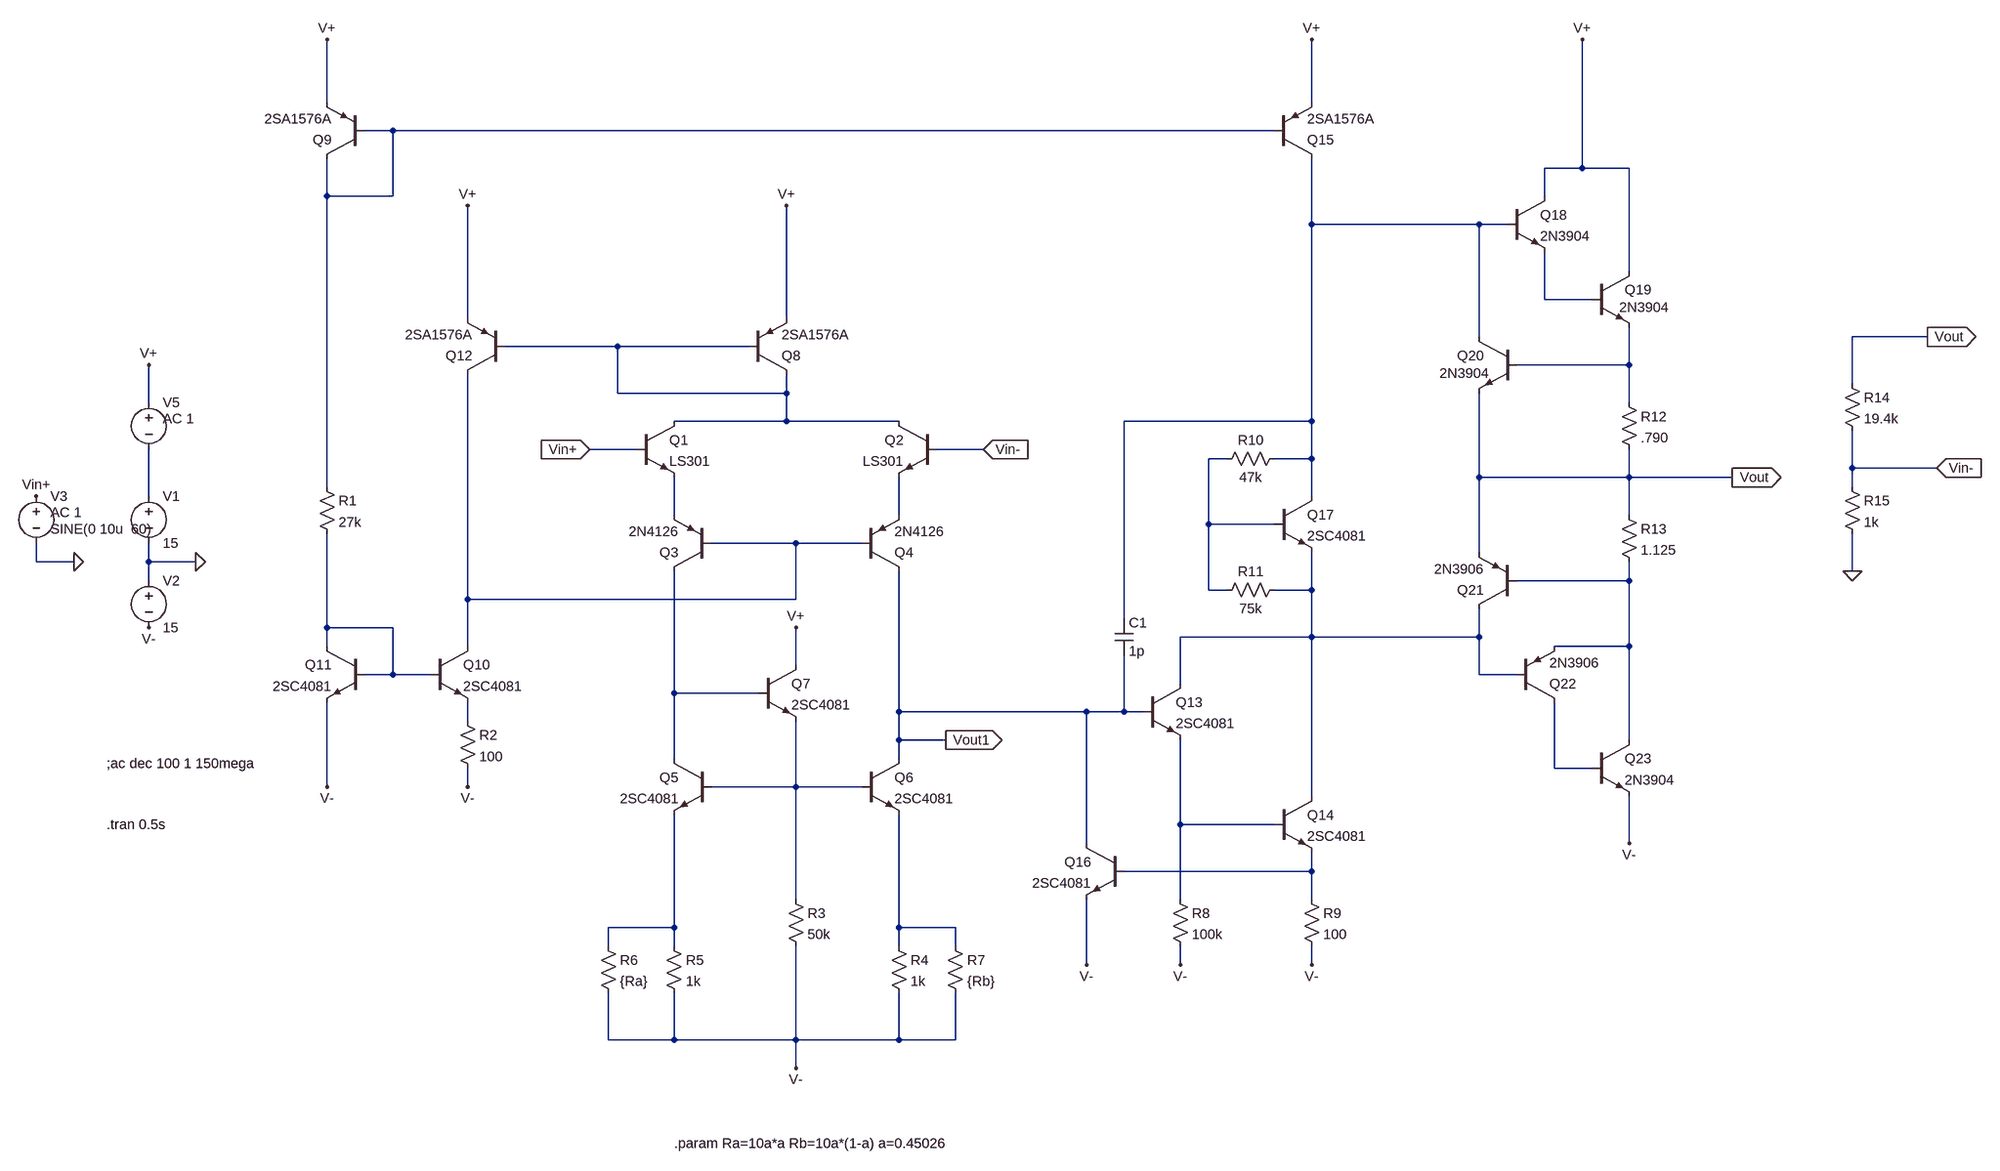
[diagram p0: schematic 741.asc]
741.asc, the LTspice schematic file:
Version 4
SHEET 1 3800 1252
WIRE 16 -736 16 -912
WIRE 1696 -736 1696 -912
WIRE 128 -688 80 -688
WIRE 1632 -688 128 -688
WIRE 2256 -624 2256 -912
WIRE 2256 -624 2192 -624
WIRE 2336 -624 2256 -624
WIRE 16 -576 16 -640
WIRE 128 -576 128 -688
WIRE 128 -576 16 -576
WIRE 2192 -576 2192 -624
WIRE 1696 -528 1696 -640
WIRE 2080 -528 1696 -528
WIRE 2128 -528 2080 -528
WIRE 2336 -448 2336 -624
WIRE 2192 -400 2192 -480
WIRE 2272 -400 2192 -400
WIRE 256 -368 256 -560
WIRE 800 -368 800 -560
WIRE 2080 -336 2080 -528
WIRE 3680 -336 3552 -336
WIRE 512 -320 320 -320
WIRE 736 -320 512 -320
WIRE 2336 -288 2336 -352
WIRE 2336 -288 2144 -288
WIRE 3552 -256 3552 -336
WIRE 512 -240 512 -320
WIRE 800 -240 800 -272
WIRE 800 -240 512 -240
WIRE -288 -224 -288 -288
WIRE 2336 -224 2336 -288
WIRE 800 -192 800 -240
WIRE 800 -192 608 -192
WIRE 992 -192 800 -192
WIRE 1696 -192 1696 -528
WIRE 1696 -192 1376 -192
WIRE 544 -144 464 -144
WIRE 1136 -144 1056 -144
WIRE 1552 -128 1520 -128
WIRE 1696 -128 1696 -192
WIRE 1696 -128 1632 -128
WIRE 3552 -112 3552 -176
WIRE 3696 -112 3552 -112
WIRE 2080 -96 2080 -240
WIRE 2336 -96 2336 -144
WIRE 2336 -96 2080 -96
WIRE 2512 -96 2336 -96
WIRE 16 -80 16 -576
WIRE 3552 -80 3552 -112
WIRE -288 -64 -288 -144
WIRE 1696 -64 1696 -128
WIRE 608 -32 608 -96
WIRE 992 -32 992 -96
WIRE 2336 -32 2336 -96
WIRE 1520 -16 1520 -128
WIRE 1632 -16 1520 -16
WIRE 816 16 672 16
WIRE 928 16 816 16
WIRE 2080 32 2080 -96
WIRE -480 48 -480 16
WIRE -416 48 -480 48
WIRE -288 48 -288 16
WIRE -208 48 -288 48
WIRE 3552 64 3552 0
WIRE -288 80 -288 48
WIRE 2336 80 2336 48
WIRE 2336 80 2144 80
WIRE 1520 96 1520 -16
WIRE 1552 96 1520 96
WIRE 1696 96 1696 32
WIRE 1696 96 1632 96
WIRE 256 112 256 -272
WIRE 816 112 816 16
WIRE 816 112 256 112
WIRE 1376 144 1376 -192
WIRE 16 160 16 0
WIRE 128 160 16 160
WIRE 1696 176 1696 96
WIRE 1696 176 1472 176
WIRE 2080 176 2080 128
WIRE 2080 176 1696 176
WIRE 16 192 16 160
WIRE 256 192 256 112
WIRE 2336 192 2336 80
WIRE 2336 192 2208 192
WIRE 816 224 816 160
WIRE 128 240 128 160
WIRE 128 240 80 240
WIRE 192 240 128 240
WIRE 2080 240 2080 176
WIRE 2144 240 2080 240
WIRE 1472 256 1472 176
WIRE 608 272 608 64
WIRE 752 272 608 272
WIRE 992 304 992 64
WIRE 1312 304 992 304
WIRE 1376 304 1376 208
WIRE 1376 304 1312 304
WIRE 1408 304 1376 304
WIRE 256 320 256 288
WIRE 992 352 992 304
WIRE 1072 352 992 352
WIRE 2336 352 2336 192
WIRE 608 384 608 272
WIRE 992 384 992 352
WIRE 2208 400 2208 288
WIRE 2272 400 2208 400
WIRE 16 432 16 288
WIRE 256 432 256 400
WIRE 816 432 816 320
WIRE 816 432 672 432
WIRE 928 432 816 432
WIRE 1696 448 1696 176
WIRE 1472 496 1472 352
WIRE 1632 496 1472 496
WIRE 1312 528 1312 304
WIRE 2336 528 2336 448
WIRE 1696 576 1696 544
WIRE 1696 576 1376 576
WIRE 816 624 816 432
WIRE 1472 624 1472 496
WIRE 1696 624 1696 576
WIRE 608 672 608 480
WIRE 608 672 496 672
WIRE 992 672 992 480
WIRE 1088 672 992 672
WIRE 496 704 496 672
WIRE 608 704 608 672
WIRE 992 704 992 672
WIRE 1088 704 1088 672
WIRE 1312 736 1312 624
WIRE 1472 736 1472 704
WIRE 1696 736 1696 704
WIRE 496 864 496 784
WIRE 608 864 608 784
WIRE 608 864 496 864
WIRE 816 864 816 704
WIRE 816 864 608 864
WIRE 992 864 992 784
WIRE 992 864 816 864
WIRE 1088 864 1088 784
WIRE 1088 864 992 864
WIRE 816 912 816 864
FLAG -208 48 0
FLAG -288 160 V-
FLAG 16 432 V-
FLAG 16 -912 V+
FLAG 256 432 V-
FLAG 256 -560 V+
FLAG 800 -560 V+
FLAG -416 48 0
FLAG -480 -64 Vin+
FLAG 464 -144 Vin+
IOPIN 464 -144 In
FLAG 1136 -144 Vin-
IOPIN 1136 -144 In
FLAG 1072 352 Vout1
IOPIN 1072 352 Out
FLAG 816 160 V+
FLAG 816 912 V-
FLAG 1472 736 V-
FLAG 1696 736 V-
FLAG 1696 -912 V+
FLAG 1312 736 V-
FLAG 2256 -912 V+
FLAG 2336 528 V-
FLAG 2512 -96 Vout
IOPIN 2512 -96 Out
FLAG 3552 64 0
FLAG 3696 -112 Vin-
IOPIN 3696 -112 In
FLAG 3680 -336 Vout
IOPIN 3680 -336 Out
FLAG -288 -288 V+
SYMBOL voltage -288 -80 R0
WINDOW 123 0 0 Left 0
WINDOW 39 0 0 Left 0
SYMATTR InstName V1
SYMATTR Value 15
SYMBOL voltage -288 64 R0
WINDOW 123 0 0 Left 0
WINDOW 39 0 0 Left 0
SYMATTR InstName V2
SYMATTR Value 15
SYMBOL res 0 -96 R0
SYMATTR InstName R1
SYMATTR Value 27k
SYMBOL res 240 304 R0
SYMATTR InstName R2
SYMATTR Value 100
SYMBOL pnp 736 -272 M180
SYMATTR InstName Q8
SYMATTR Value 2SA1576A
SYMBOL voltage -480 -80 R0
WINDOW 123 24 44 Left 2
WINDOW 39 0 0 Left 0
WINDOW 3 24 72 Left 2
SYMATTR Value2 AC 1
SYMATTR Value SINE(0 10u  60)
SYMATTR InstName V3
SYMBOL npn 544 -192 R0
SYMATTR InstName Q1
SYMATTR Value LS301
SYMBOL pnp 672 64 R180
SYMATTR InstName Q3
SYMATTR Value 2N4126
SYMBOL pnp 928 64 M180
SYMATTR InstName Q4
SYMATTR Value 2N4126
SYMBOL npn 672 384 M0
SYMATTR InstName Q5
SYMATTR Value 2SC4081
SYMBOL res 800 608 R0
SYMATTR InstName R3
SYMATTR Value 50k
SYMBOL res 976 688 R0
SYMATTR InstName R4
SYMATTR Value 1k
SYMBOL res 592 688 R0
SYMATTR InstName R5
SYMATTR Value 1k
SYMBOL res 480 688 R0
SYMATTR InstName R6
SYMATTR Value {Ra}
SYMBOL res 1072 688 R0
SYMATTR InstName R7
SYMATTR Value {Rb}
SYMBOL npn 928 384 R0
SYMATTR InstName Q6
SYMATTR Value 2SC4081
SYMBOL npn 752 224 R0
SYMATTR InstName Q7
SYMATTR Value 2SC4081
SYMBOL npn 1056 -192 M0
SYMATTR InstName Q2
SYMATTR Value LS301
SYMBOL pnp 80 -640 R180
SYMATTR InstName Q9
SYMATTR Value 2SA1576A
SYMBOL pnp 320 -272 R180
SYMATTR InstName Q12
SYMATTR Value 2SA1576A
SYMBOL npn 192 192 R0
SYMATTR InstName Q10
SYMATTR Value 2SC4081
SYMBOL npn 80 192 M0
SYMATTR InstName Q11
SYMATTR Value 2SC4081
SYMBOL npn 1408 256 R0
SYMATTR InstName Q13
SYMATTR Value 2SC4081
SYMBOL npn 1632 448 R0
SYMATTR InstName Q14
SYMATTR Value 2SC4081
SYMBOL res 1456 608 R0
SYMATTR InstName R8
SYMATTR Value 100k
SYMBOL res 1680 608 R0
SYMATTR InstName R9
SYMATTR Value 100
SYMBOL pnp 1632 -640 M180
SYMATTR InstName Q15
SYMATTR Value 2SA1576A
SYMBOL npn 1376 528 M0
SYMATTR InstName Q16
SYMATTR Value 2SC4081
SYMBOL npn 1632 -64 R0
SYMATTR InstName Q17
SYMATTR Value 2SC4081
SYMBOL res 1648 -144 R90
WINDOW 0 0 56 VBottom 2
WINDOW 3 32 56 VTop 2
SYMATTR InstName R10
SYMATTR Value 47k
SYMBOL res 1648 80 R90
WINDOW 0 0 56 VBottom 2
WINDOW 3 32 56 VTop 2
SYMATTR InstName R11
SYMATTR Value 75k
SYMBOL npn 2128 -576 R0
SYMATTR InstName Q18
SYMATTR Value 2N3904
SYMBOL npn 2272 -448 R0
WINDOW 3 47 62 Left 2
SYMATTR Value 2N3904
SYMATTR InstName Q19
SYMBOL res 2320 -240 R0
SYMATTR InstName R12
SYMATTR Value .790
SYMBOL res 2320 -48 R0
SYMATTR InstName R13
SYMATTR Value 1.125
SYMBOL npn 2144 -336 M0
WINDOW 3 47 62 Left 2
SYMATTR Value 2N3904
SYMATTR InstName Q20
SYMBOL pnp 2144 128 R180
SYMATTR InstName Q21
SYMATTR Value 2N3906
SYMBOL pnp 2144 288 M180
SYMATTR InstName Q22
SYMATTR Value 2N3906
SYMBOL npn 2272 352 R0
SYMATTR InstName Q23
SYMATTR Value 2N3904
SYMBOL cap 1360 144 R0
SYMATTR InstName C1
SYMATTR Value 1p
SYMBOL res 3536 -272 R0
SYMATTR InstName R14
SYMATTR Value 19.4k
SYMBOL res 3536 -96 R0
SYMATTR InstName R15
SYMATTR Value 1k
SYMBOL voltage -288 -240 R0
WINDOW 123 24 44 Left 2
WINDOW 39 0 0 Left 0
SYMATTR Value2 AC 1
SYMATTR InstName V5
SYMATTR Value ""
TEXT 608 1040 Left 2 !.param Ra=10a*a Rb=10a*(1-a) a=0.45026
TEXT -360 392 Left 2 !;ac dec 100 1 150mega
TEXT -360 496 Left 2 !.tran 0.5s

The netlist it stands for:
* 741.asc
V1 N007 0 15
V2 0 V- 15
R1 N001 N013 27k
R2 N015 V- 100
Q8 N004 N004 V+ 0 2SA1576A
V3 Vin+ 0 SINE(0 10u  60) AC 1
Q1 N004 Vin+ N008 0 LS301
Q3 N014 N010 N008 0 2N4126
Q4 Vout1 N010 N009 0 2N4126
Q5 N014 N017 N020 0 2SC4081
R3 N017 V- 50k
R4 N021 V- 1k
R5 N020 V- 1k
R6 N020 V- {Ra}
R7 N021 V- {Rb}
Q6 Vout1 N017 N021 0 2SC4081
Q7 V+ N014 N017 0 2SC4081
Q2 N004 Vin- N009 0 LS301
Q9 N001 N001 V+ 0 2SA1576A
Q12 N010 N004 V+ 0 2SA1576A
Q10 N010 N013 N015 0 2SC4081
Q11 N013 N013 V- 0 2SC4081
Q13 N012 Vout1 N018 0 2SC4081
Q14 N012 N018 N019 0 2SC4081
R8 N018 V- 100k
R9 N019 V- 100
Q15 N002 N001 V+ 0 2SA1576A
Q16 Vout1 N019 V- 0 2SC4081
Q17 N002 N006 N012 0 2SC4081
R10 N002 N006 47k
R11 N012 N006 75k
Q18 V+ N002 N003 0 2N3904
Q19 V+ N003 N005 0 2N3904
R12 N005 Vout .790
R13 Vout N011 1.125
Q20 N002 N005 Vout 0 2N3904
Q21 N012 N011 Vout 0 2N3906
Q22 N016 N012 N011 0 2N3906
Q23 N011 N016 V- 0 2N3904
C1 N002 Vout1 1p
R14 Vout Vin- 19.4k
R15 Vin- 0 1k
V5 V+ N007 AC 1
.model NPN NPN
.model PNP PNP
.lib standard.bjt
.param Ra=10a*a Rb=10a*(1-a) a=0.45026
;ac dec 100 1 150mega
.tran 0.5s
.backanno
.end